# EAGLE schematic SJH-5XD (EAGLE 9.6.2)
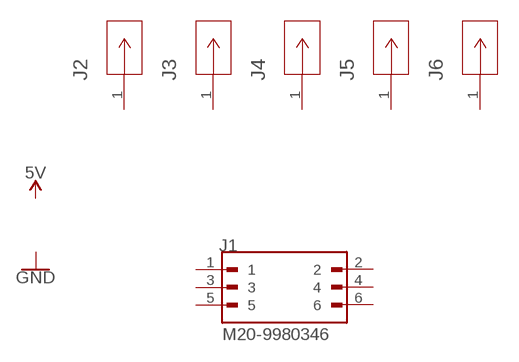
[diagram p0: schematic, sheet 1]

## Parts
J1  M20-9980346  [HARWIN_M20-9980346]
J2  450-3326-01-03-00  [CONN_450-3326-01-XX-00_CBN]
J3  450-3326-01-03-00  [CONN_450-3326-01-XX-00_CBN]
J4  450-3326-01-03-00  [CONN_450-3326-01-XX-00_CBN]
J5  450-3326-01-03-00  [CONN_450-3326-01-XX-00_CBN]
J6  450-3326-01-03-00  [CONN_450-3326-01-XX-00_CBN]
Unconnected: J1.1 J1.2 J1.3 J1.4 J1.5 J1.6 J2.1 J3.1 J4.1 J5.1 J6.1

## Library data of the parts
J1 = M20-9980346:M20-9980346; MANUFACTURER: HARWIN; STANDARD: Manufacturer Recommendations
J2-J6 = Methane:450-3326-01-03-00; COPYRIGHT: Copyright (C) 2024 Ultra Librarian. All rights reserved.; MANUFACTURER_PART_NUMBER: 450-3326-01-03-00; MFR_NAME: Cambion